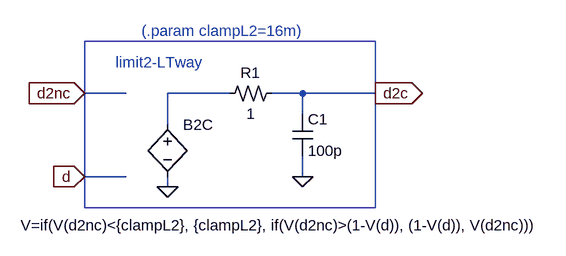
[diagram p0: schematic limit2.asc]
limit2.asc, the LTspice schematic file:
Version 4
SHEET 1 2260 2504
WIRE 176 80 112 80
WIRE 336 80 240 80
WIRE 448 80 400 80
WIRE 560 80 448 80
WIRE 448 112 448 80
WIRE 240 128 240 80
WIRE 176 208 112 208
WIRE 448 208 448 176
WIRE 240 224 240 208
FLAG 112 80 d2nc
IOPIN 112 80 In
FLAG 560 80 d2c
IOPIN 560 80 Out
FLAG 240 224 0
FLAG 112 208 d
IOPIN 112 208 In
FLAG 448 208 0
SYMBOL bv 240 112 R0
WINDOW 3 -226 171 Left 0
SYMATTR Value V=if(V(d2nc)<{clampL2}, {clampL2}, if(V(d2nc)>(1-V(d)), (1-V(d)), V(d2nc)))
SYMATTR InstName B2C
SYMBOL res2 400 64 R90
WINDOW 0 0 32 VBottom 0
WINDOW 3 32 32 VTop 0
SYMATTR InstName R1
SYMATTR Value 1
SYMBOL cap 432 112 R0
SYMATTR InstName C1
SYMATTR Value 100p
TEXT 160 32 Left 0 ;limit2-LTway
TEXT 200 -16 Left 0 ;(.param clampL2=16m)
RECTANGLE Normal 560 256 112 0

The netlist it stands for:
* limit2.asc
B2C N001 0 V=if(V(d2nc)<{clampL2}, {clampL2}, if(V(d2nc)>(1-V(d)), (1-V(d)), V(d2nc)))
R1 d2c N001 1
C1 d2c 0 100p
* limit2-LTway
* (.param clampL2=16m)
.backanno
.end